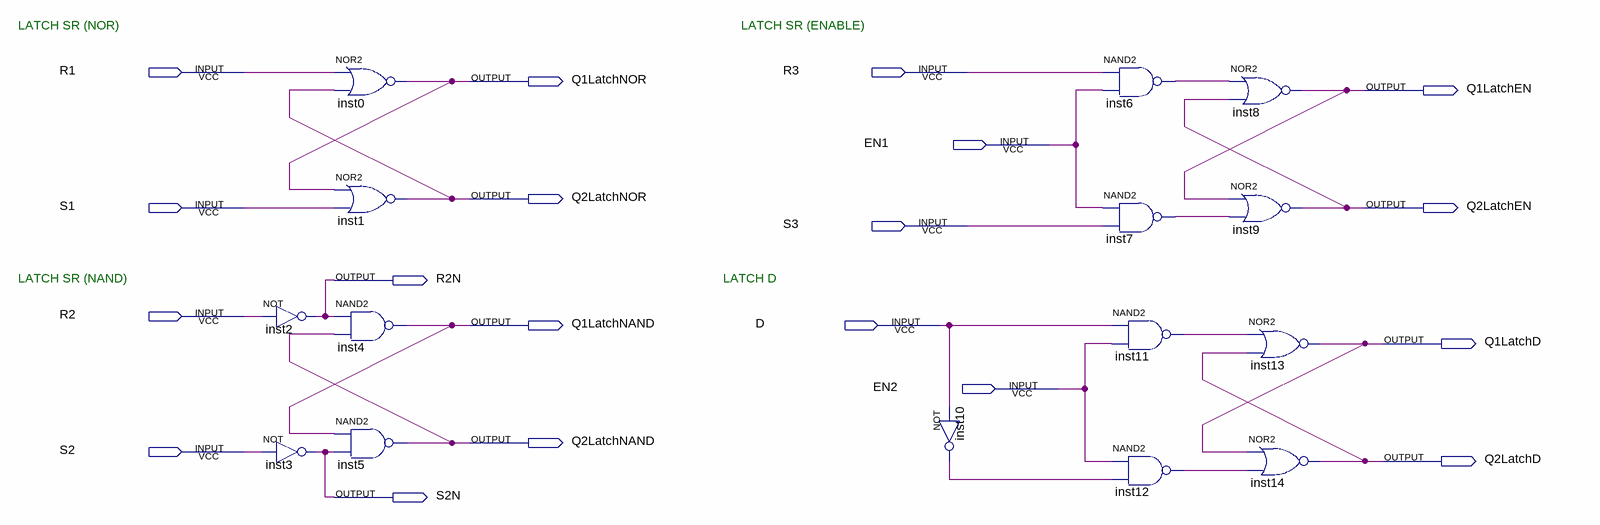
[diagram p0: schematic sheet]
// Quartus schematic latches.bdf as structural Verilog: 15 symbols, 19 pins
module latches (
  input  R1,
  input  R3,
  input  EN1,
  input  S1,
  input  S3,
  input  R2,
  input  D,
  input  EN2,
  input  S2,
  output Q1LatchNOR,
  output Q1LatchEN,
  output Q2LatchNOR,
  output Q2LatchEN,
  output R2N,
  output Q1LatchNAND,
  output Q1LatchD,
  output Q2LatchNAND,
  output Q2LatchD,
  output S2N
);

  wire inst6_out, inst7_out, inst10_out, inst11_out, inst12_out;

  not inst2 (R2N, R2);
  not inst3 (S2N, S2);
  nor inst0 (Q1LatchNOR, R1, Q2LatchNOR);
  nor inst1 (Q2LatchNOR, Q1LatchNOR, S1);
  nand inst4 (Q1LatchNAND, R2N, Q2LatchNAND);
  nand inst5 (Q2LatchNAND, Q1LatchNAND, S2N);
  not inst10 (inst10_out, D);
  nand inst6 (inst6_out, R3, EN1);
  nand inst7 (inst7_out, EN1, S3);
  nand inst11 (inst11_out, D, EN2);
  nand inst12 (inst12_out, EN2, inst10_out);
  nor inst8 (Q1LatchEN, inst6_out, Q2LatchEN);
  nor inst9 (Q2LatchEN, Q1LatchEN, inst7_out);
  nor inst13 (Q1LatchD, inst11_out, Q2LatchD);
  nor inst14 (Q2LatchD, Q1LatchD, inst12_out);

  // Notes on the sheet:
  //   LATCH SR (NOR)
  //   LATCH SR (ENABLE)
  //   LATCH SR (NAND)
  //   LATCH D
endmodule
